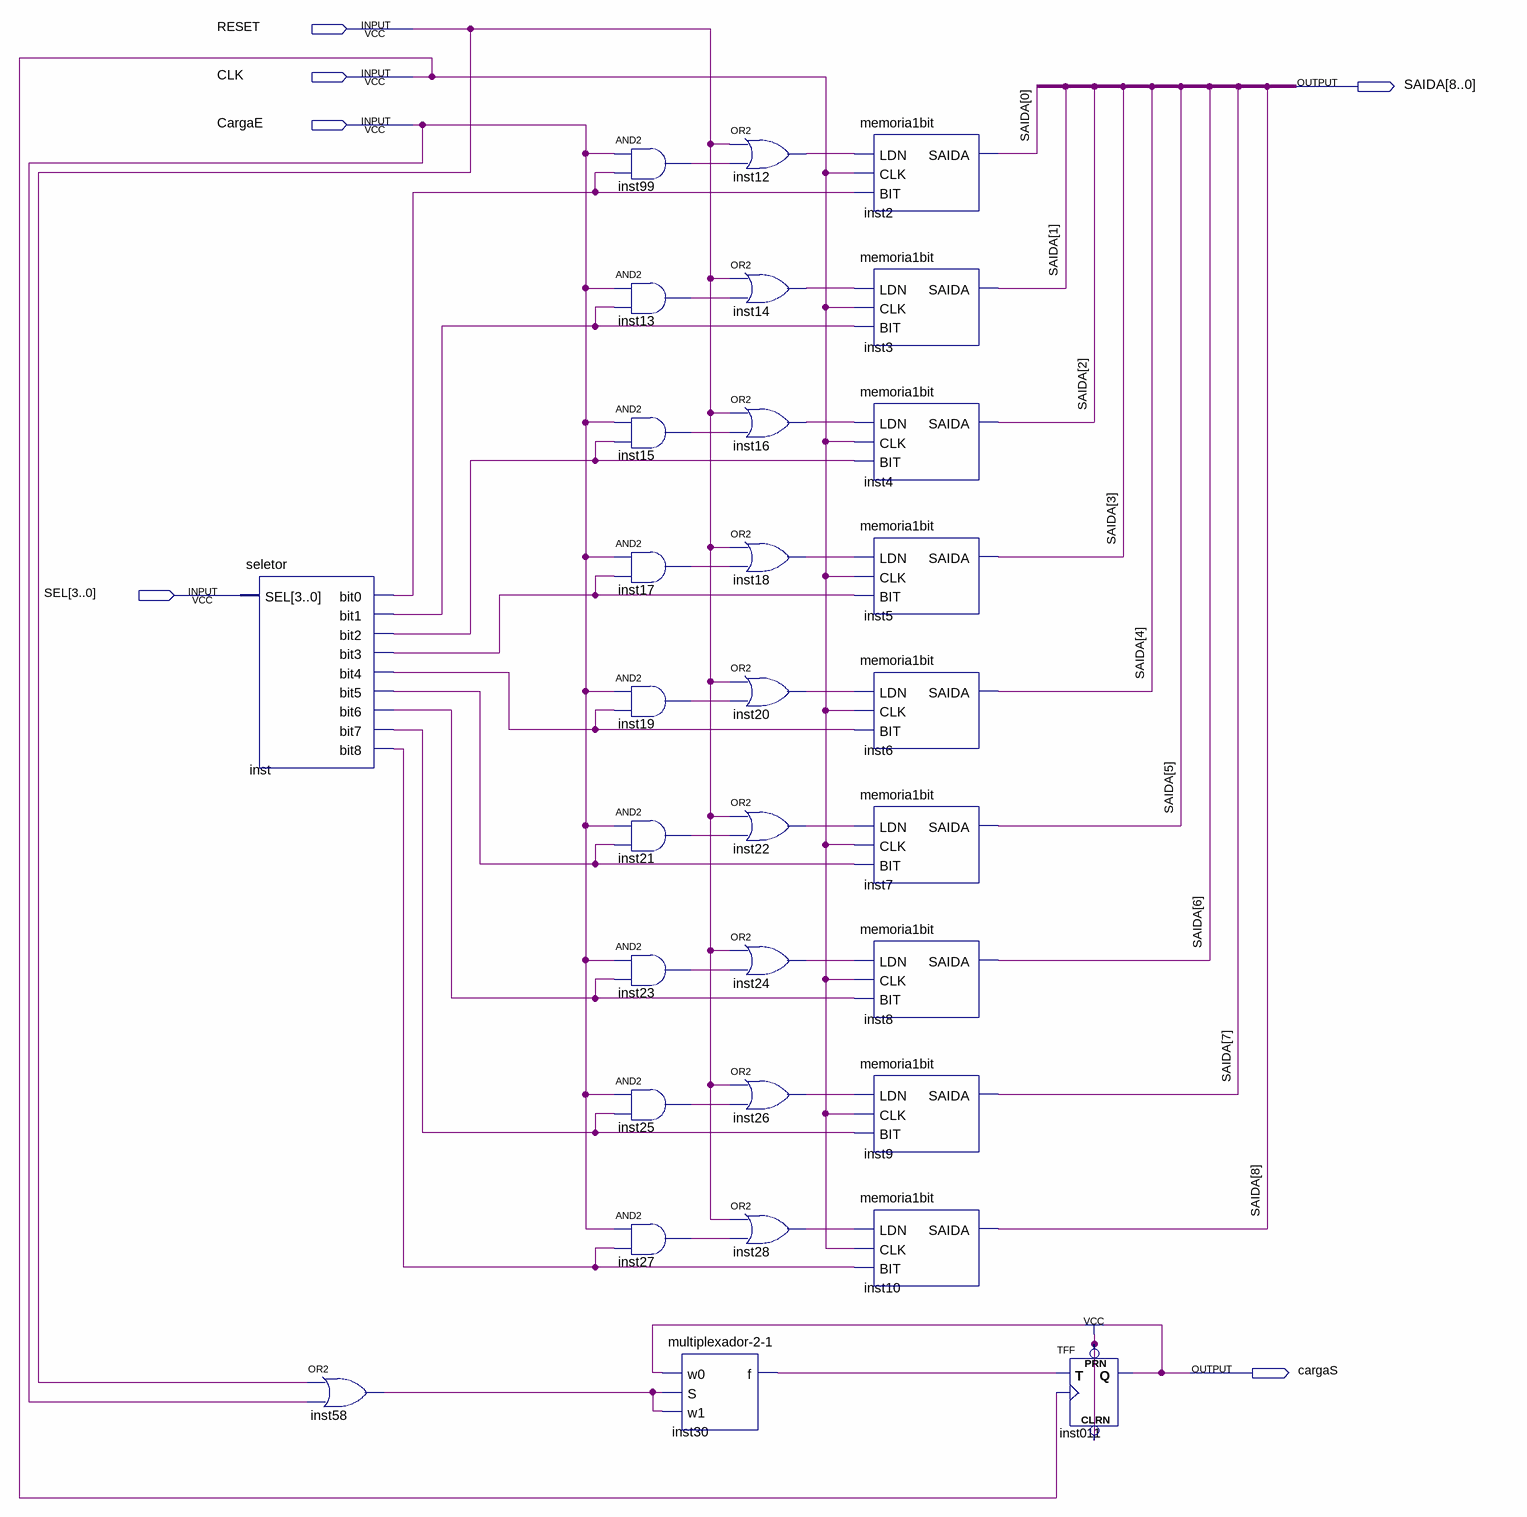
[diagram p0: schematic sheet]
// Quartus schematic memoria.bdf as structural Verilog: 31 symbols, 6 pins
module memoria (
  input  RESET,
  input  CLK,
  input  CargaE,
  input  [3:0] SEL,
  output [8:0] SAIDA,
  output cargaS
);

  wire inst12_out, inst13_out, inst14_out, inst15_out, inst16_out, inst17_out, inst18_out, inst19_out,
       inst20_out, inst21_out, inst22_out, inst23_out, inst24_out, inst25_out, inst26_out, inst27_out,
       inst28_out, inst30_f, inst58_out, inst99_out, inst_bit0, inst_bit1, inst_bit2, inst_bit3, inst_bit4,
       inst_bit5, inst_bit6, inst_bit7, inst_bit8;

  seletor inst (
    .SEL(SEL), .bit0(inst_bit0), .bit1(inst_bit1), .bit2(inst_bit2), .bit3(inst_bit3), .bit4(inst_bit4),
    .bit5(inst_bit5), .bit6(inst_bit6), .bit7(inst_bit7), .bit8(inst_bit8));
  or inst58 (inst58_out, RESET, CargaE);
  and inst99 (inst99_out, CargaE, inst_bit0);
  and inst13 (inst13_out, CargaE, inst_bit1);
  and inst15 (inst15_out, CargaE, inst_bit2);
  and inst17 (inst17_out, CargaE, inst_bit3);
  and inst19 (inst19_out, CargaE, inst_bit4);
  and inst21 (inst21_out, CargaE, inst_bit5);
  and inst23 (inst23_out, CargaE, inst_bit6);
  and inst25 (inst25_out, CargaE, inst_bit7);
  and inst27 (inst27_out, CargaE, inst_bit8);
  \multiplexador-2-1  inst30 (.w0(cargaS), .S(inst58_out), .w1(inst58_out), .f(inst30_f));
  or inst12 (inst12_out, RESET, inst99_out);
  or inst14 (inst14_out, RESET, inst13_out);
  or inst16 (inst16_out, RESET, inst15_out);
  or inst18 (inst18_out, RESET, inst17_out);
  or inst20 (inst20_out, RESET, inst19_out);
  or inst22 (inst22_out, RESET, inst21_out);
  or inst24 (inst24_out, RESET, inst23_out);
  or inst26 (inst26_out, RESET, inst25_out);
  or inst28 (inst28_out, RESET, inst27_out);
  memoria1bit inst2 (.LDN(inst12_out), .CLK(CLK), .BIT(inst_bit0), .SAIDA(SAIDA[0]));
  memoria1bit inst3 (.LDN(inst14_out), .CLK(CLK), .BIT(inst_bit1), .SAIDA(SAIDA[1]));
  memoria1bit inst4 (.LDN(inst16_out), .CLK(CLK), .BIT(inst_bit2), .SAIDA(SAIDA[2]));
  memoria1bit inst5 (.LDN(inst18_out), .CLK(CLK), .BIT(inst_bit3), .SAIDA(SAIDA[3]));
  memoria1bit inst6 (.LDN(inst20_out), .CLK(CLK), .BIT(inst_bit4), .SAIDA(SAIDA[4]));
  memoria1bit inst7 (.LDN(inst22_out), .CLK(CLK), .BIT(inst_bit5), .SAIDA(SAIDA[5]));
  memoria1bit inst8 (.LDN(inst24_out), .CLK(CLK), .BIT(inst_bit6), .SAIDA(SAIDA[6]));
  memoria1bit inst9 (.LDN(inst26_out), .CLK(CLK), .BIT(inst_bit7), .SAIDA(SAIDA[7]));
  memoria1bit inst10 (.LDN(inst28_out), .CLK(CLK), .BIT(inst_bit8), .SAIDA(SAIDA[8]));
  TFF inst011 (.PRN(1'b1), .CLRN(1'b1), .T(inst30_f), .CLK(CLK), .Q(cargaS));
endmodule
